# EAGLE schematic SBECU (EAGLE 9.6.2)
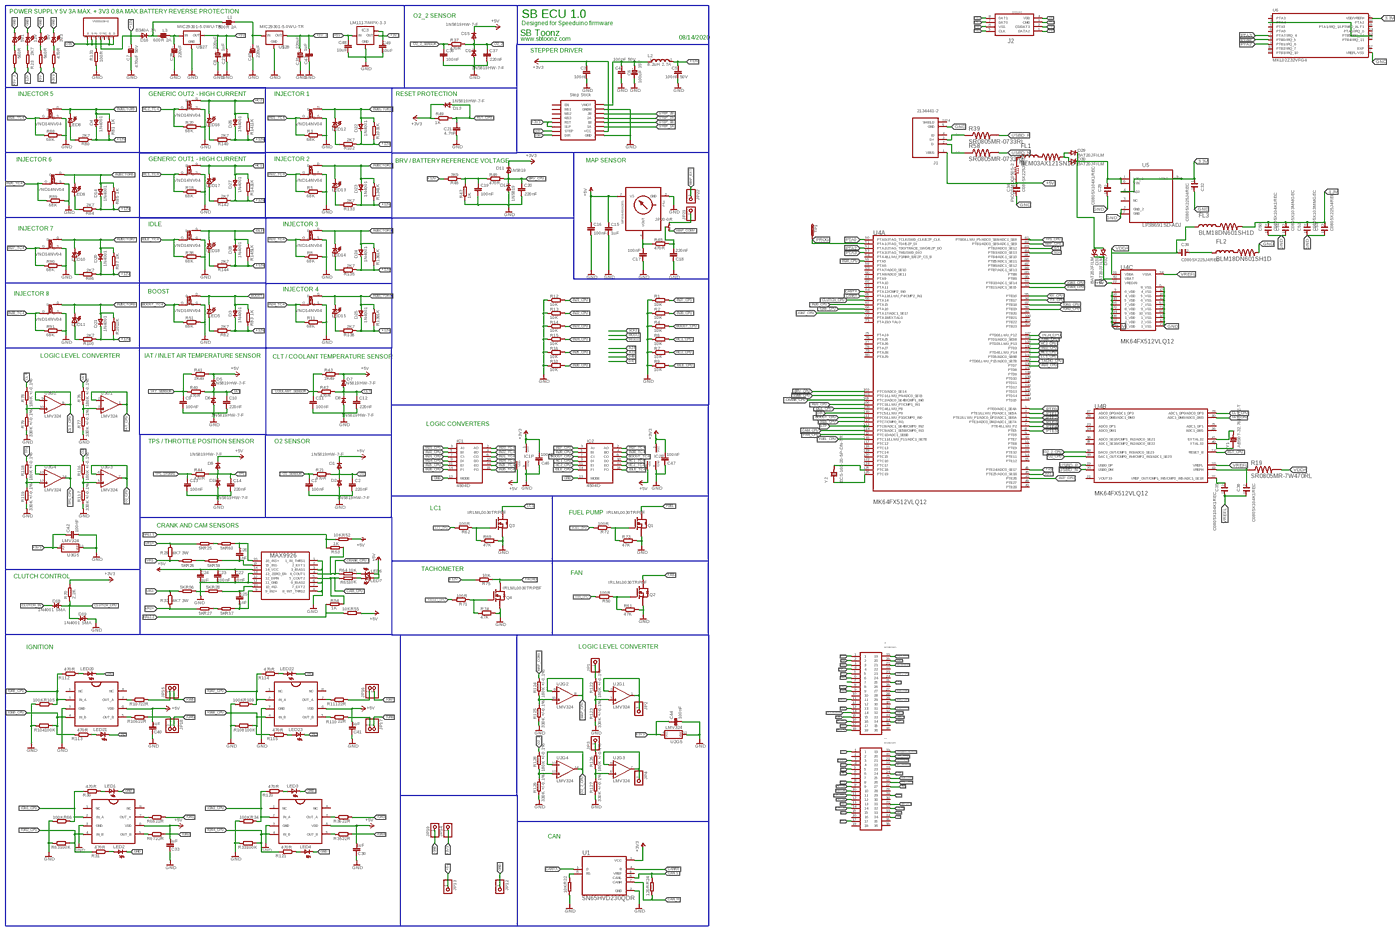
[diagram p0: schematic, sheet 1, overview]
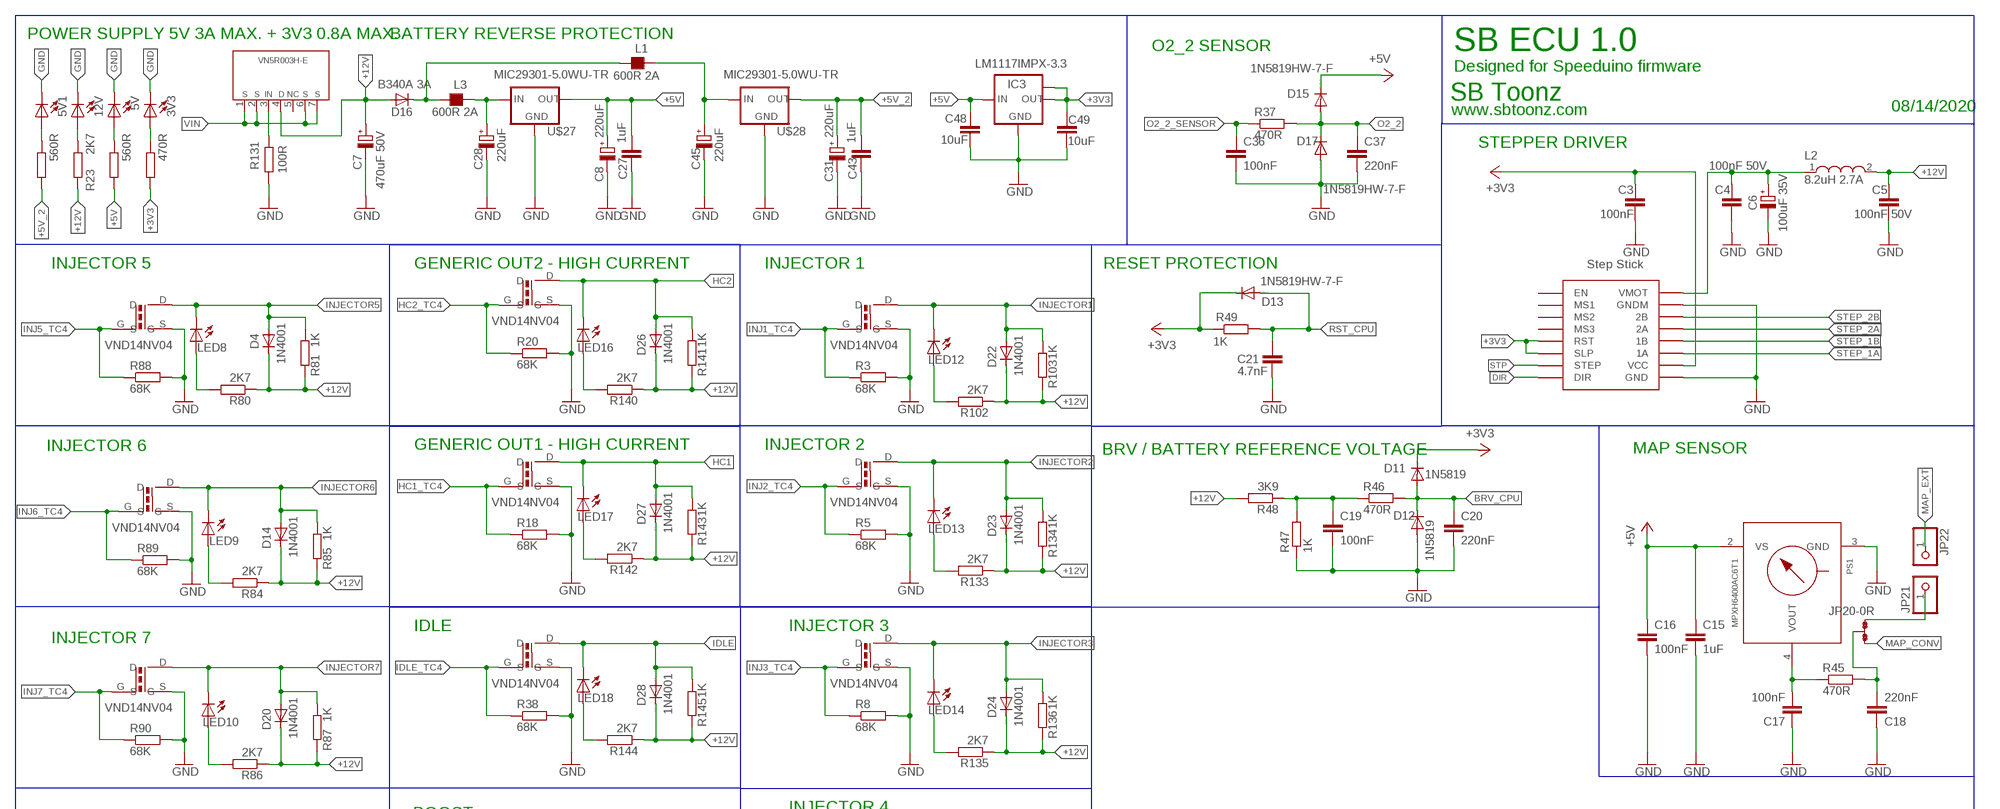
[diagram p1: schematic, sheet 1, part 1 of 4]
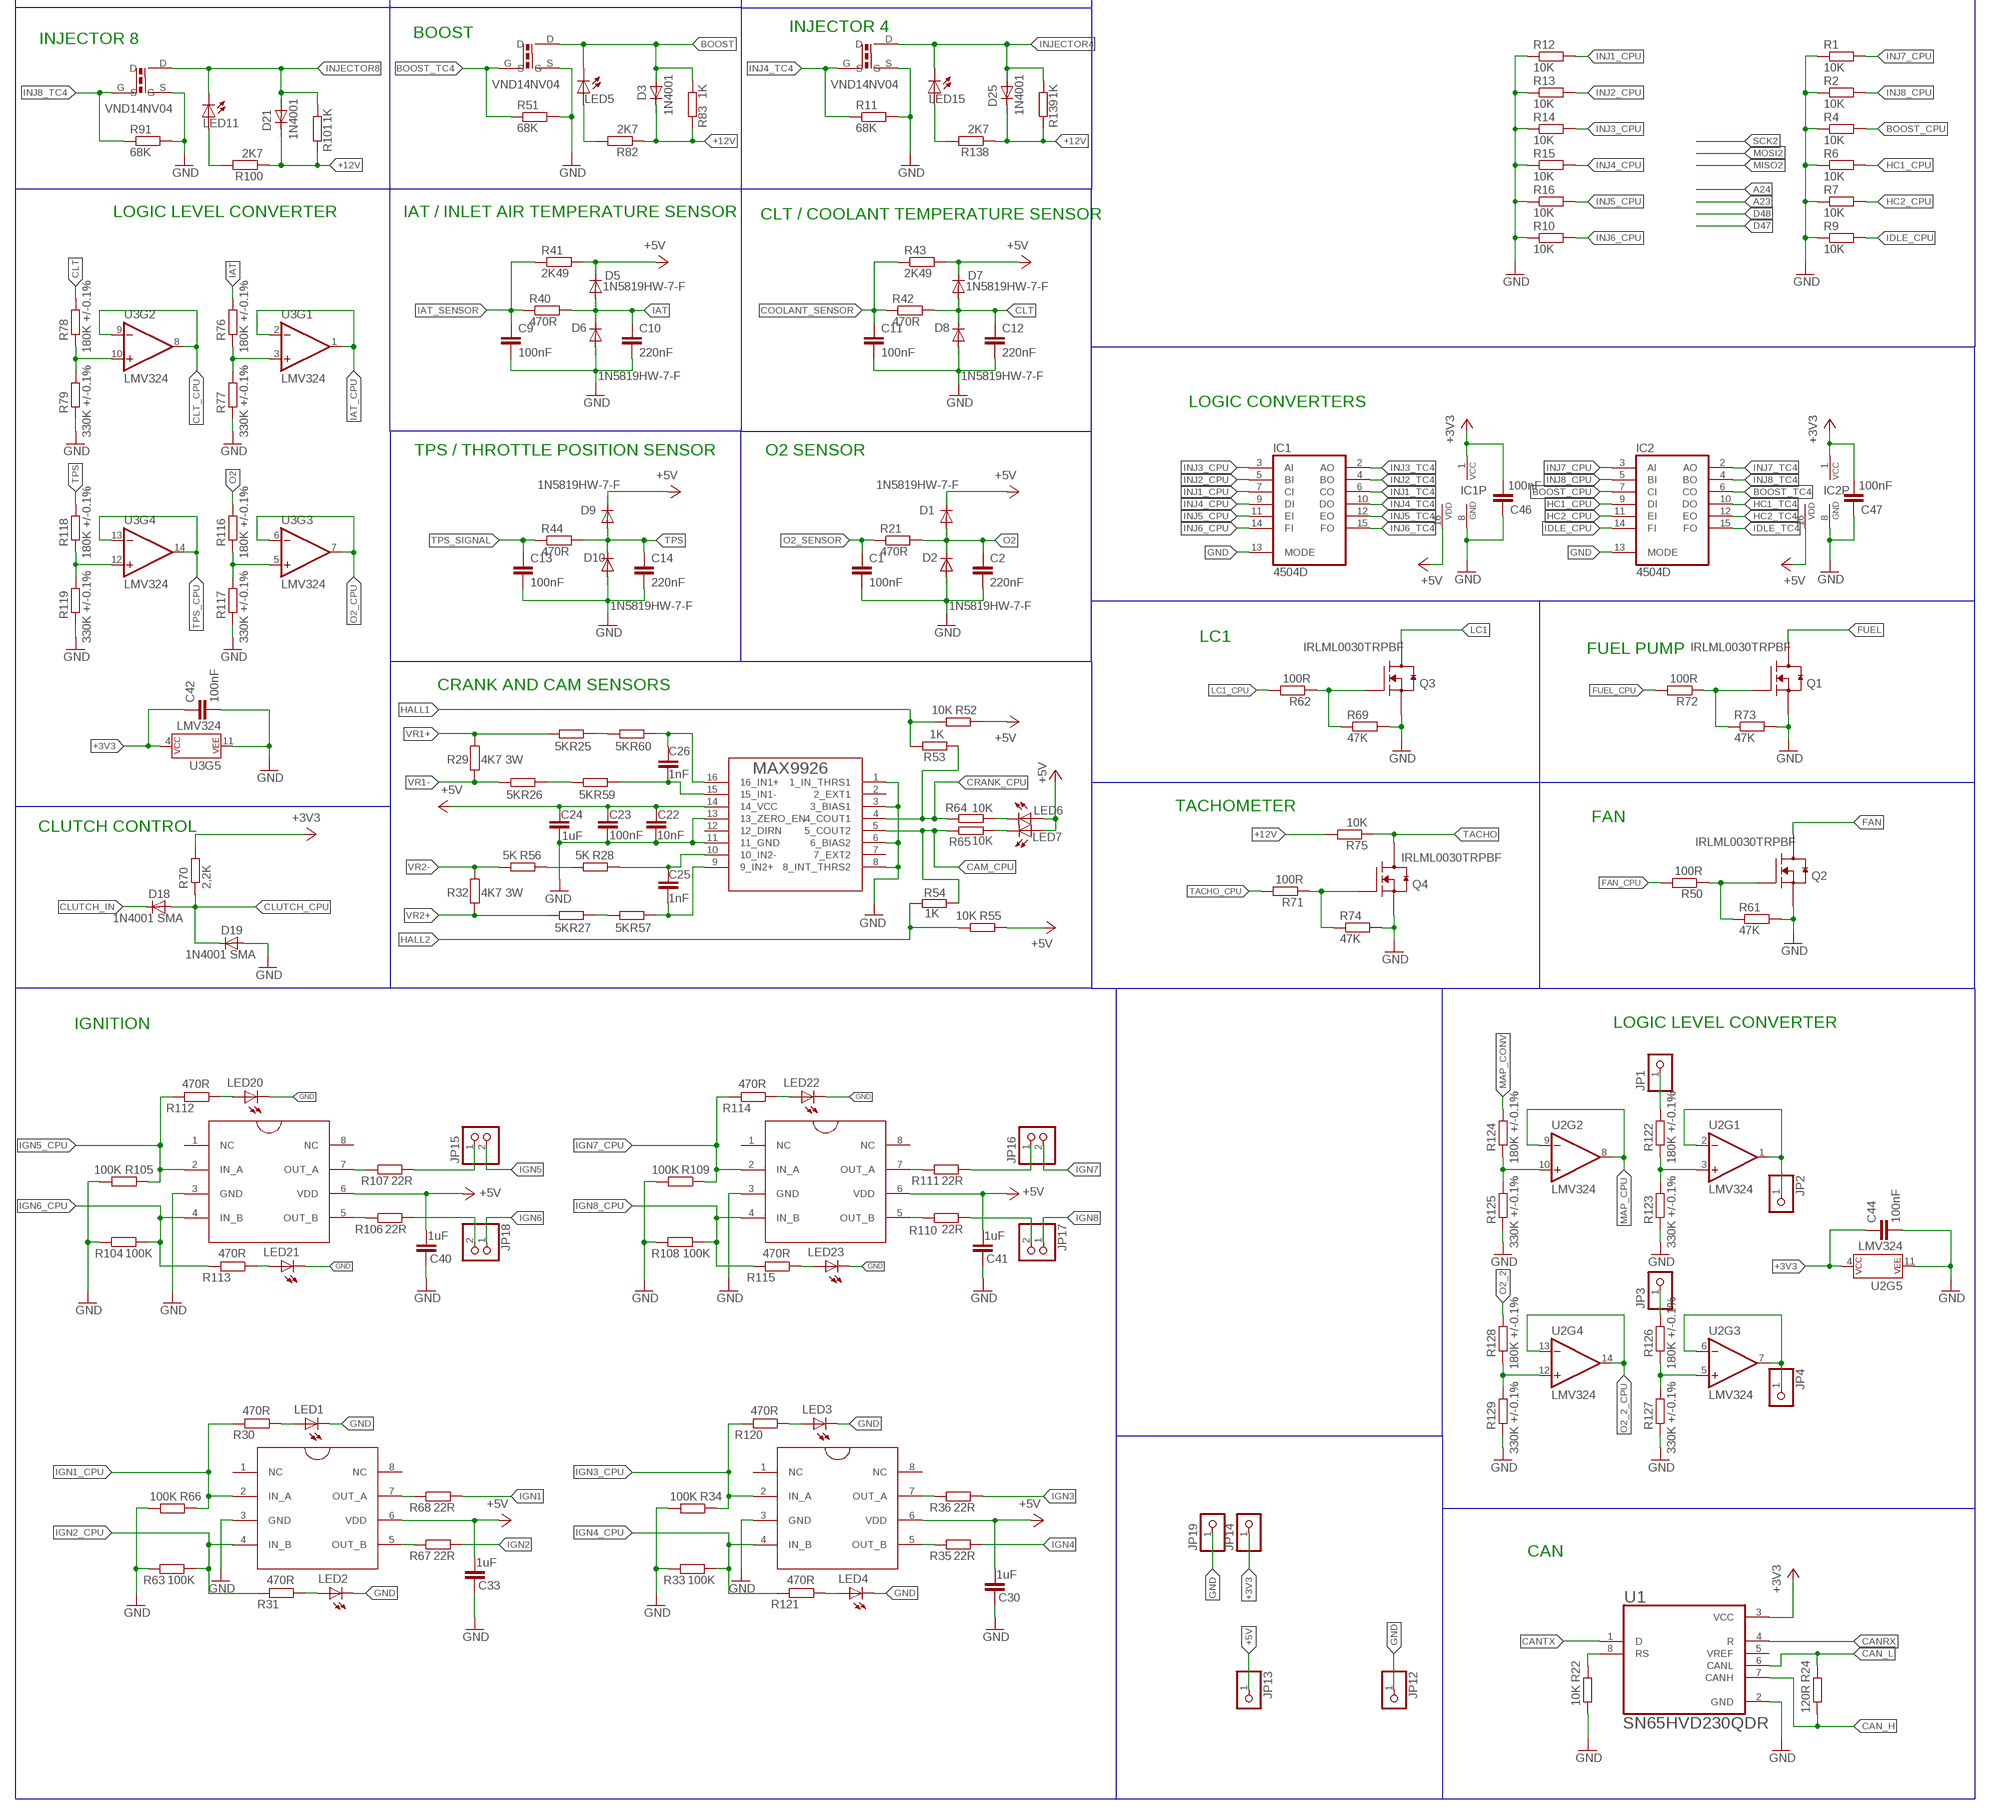
[diagram p2: schematic, sheet 1, part 2 of 4]
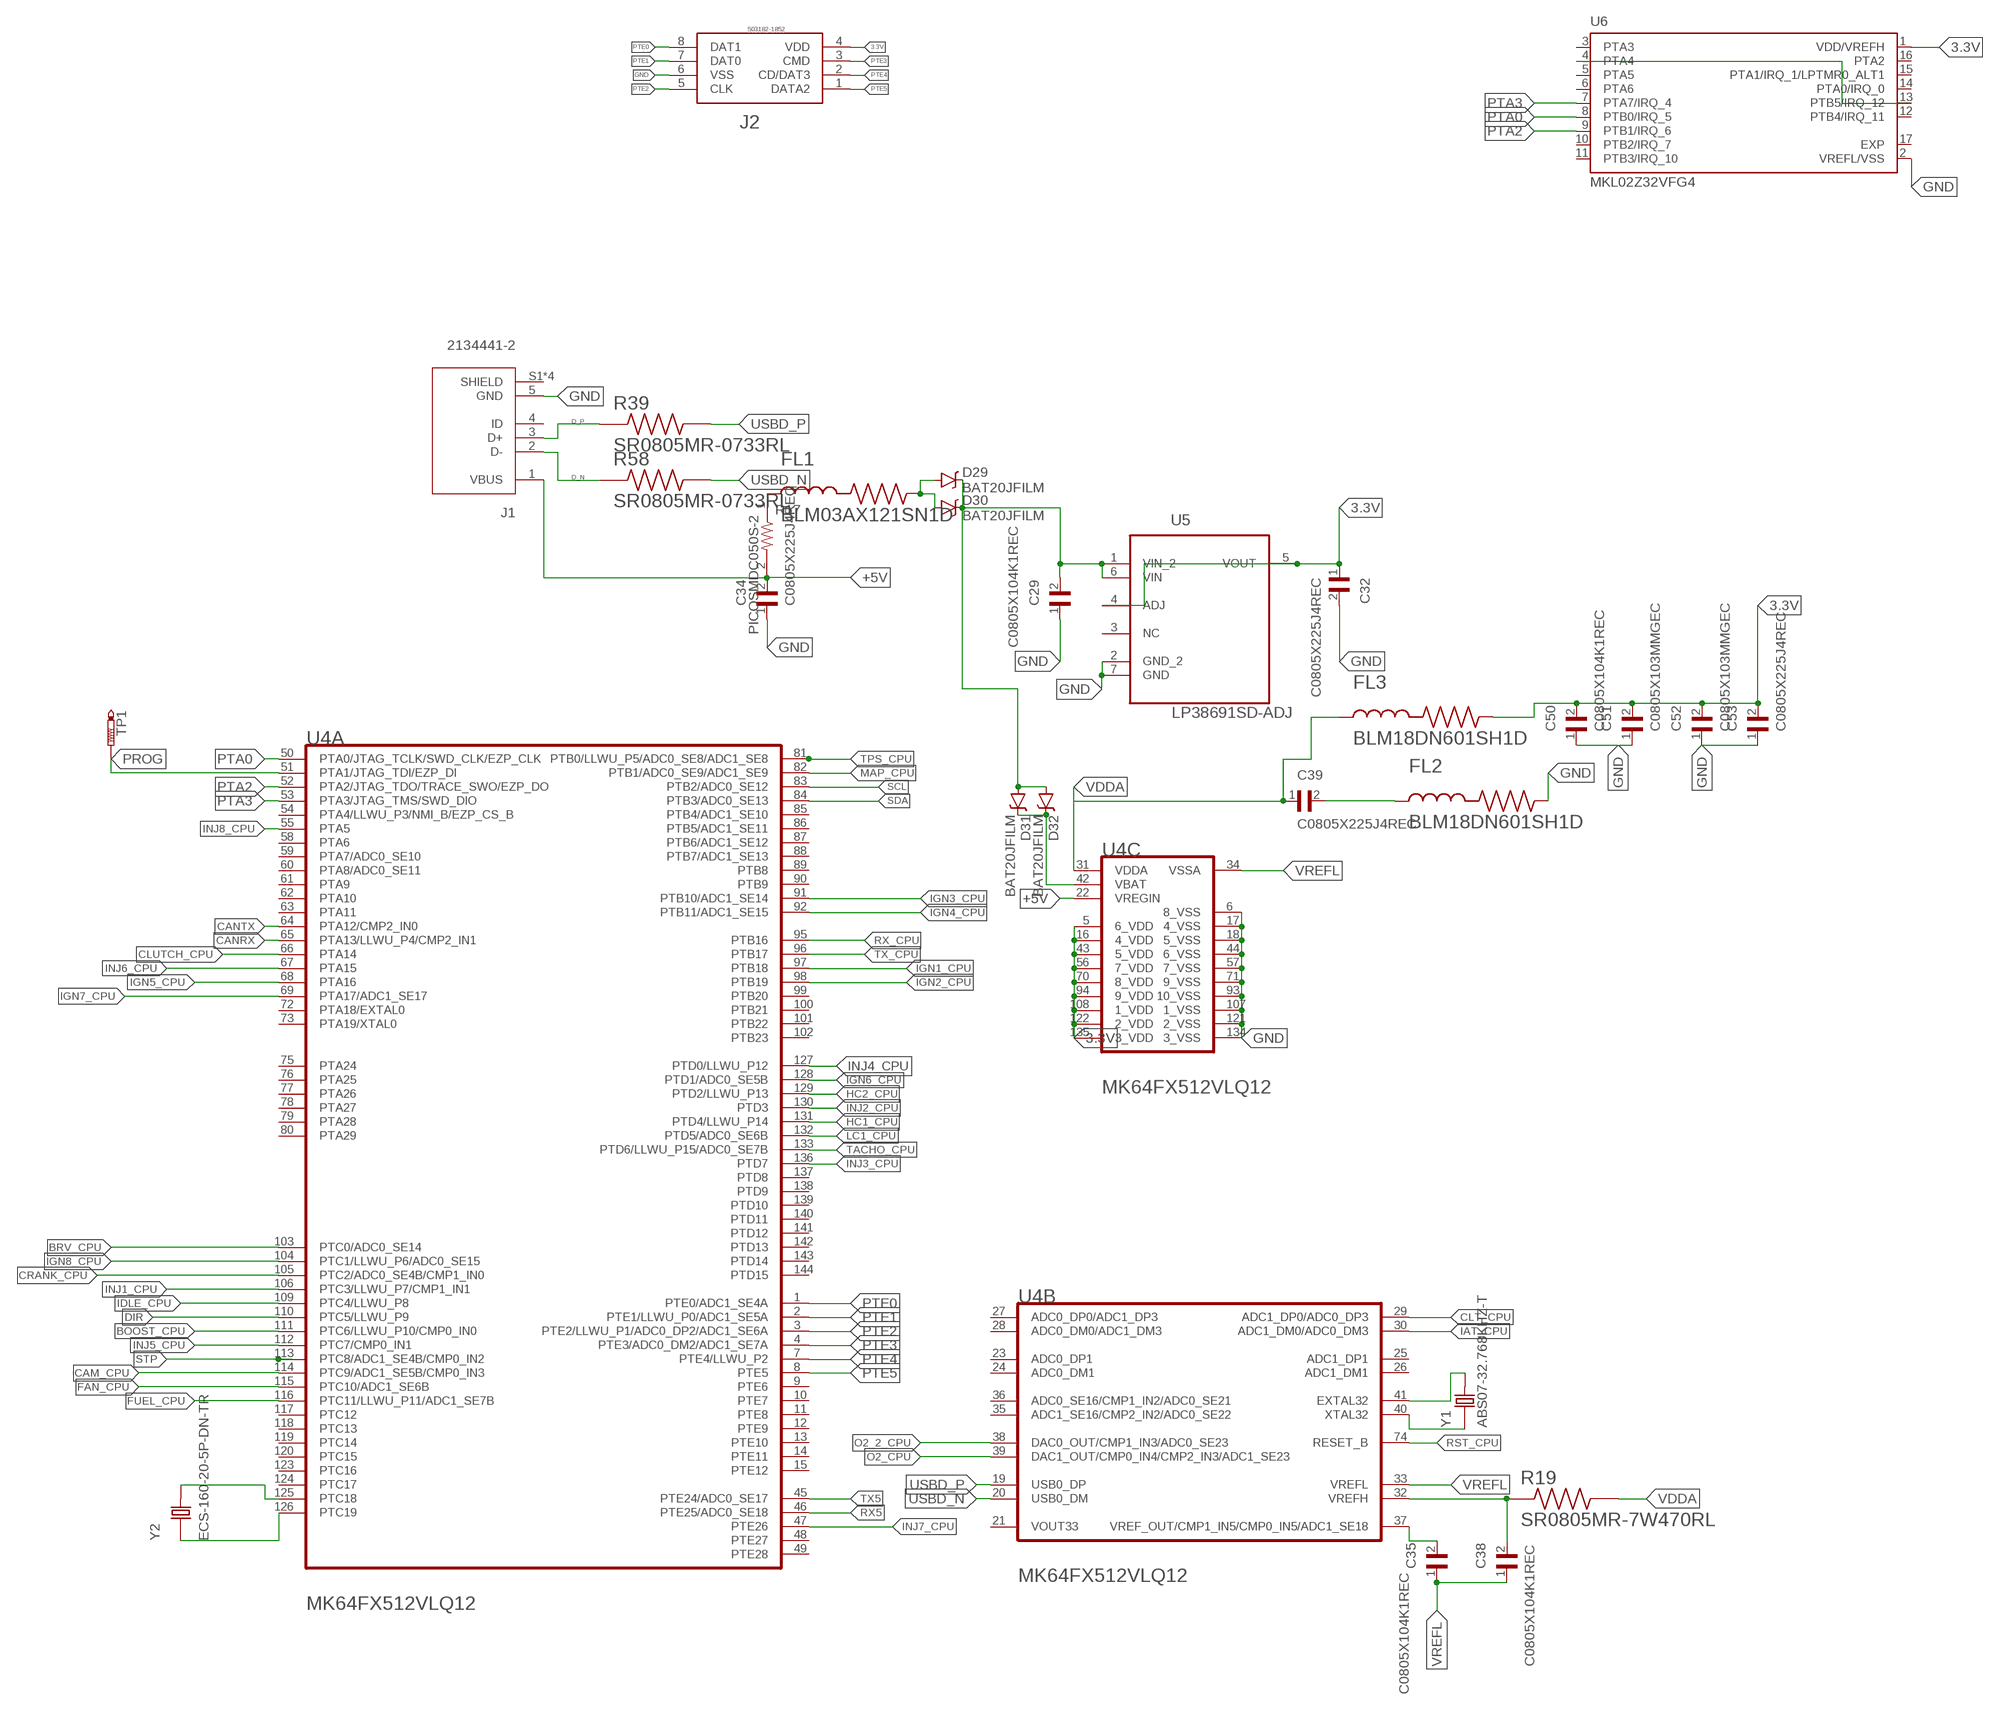
[diagram p3: schematic, sheet 1, part 3 of 4]
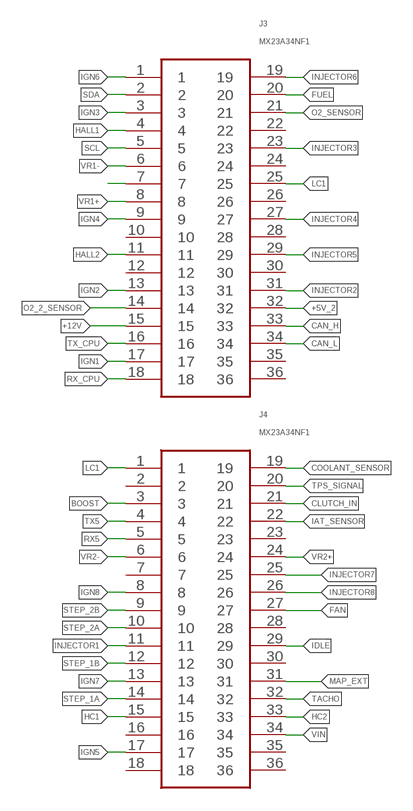
[diagram p4: schematic, sheet 1, part 4 of 4]

## Parts
3V3  LEDCHIP-LED0805  [CHIP-LED0805]
5V  LEDCHIP-LED0805  [CHIP-LED0805]
5V1  LEDCHIP-LED0805  [CHIP-LED0805]
12V  LEDCHIP-LED0805  [CHIP-LED0805]
C1  100nF  C-EUC0805  [C0805]
C2  220nF  C-EUC0805  [C0805]
C3  100nF  C-EUC0805  [C0805]
C4  100nF 50V  C-EUC0805  [C0805]
C5  100nF 50V  C-EUC0805  [C0805]
C6  100uF 35V  CPOL-EUD  [PANASONIC_D]
C7  470uF 50V  CPOL-EUG  [PANASONIC_G]
C8  220uF  CPOL-EUD  [PANASONIC_D]
C9  100nF  C-EUC0805  [C0805]
C10  220nF  C-EUC0805  [C0805]
C11  100nF  C-EUC0805  [C0805]
C12  220nF  C-EUC0805  [C0805]
C13  100nF  C-EUC0805  [C0805]
C14  220nF  C-EUC0805  [C0805]
C15  1uF  C-EUC0805  [C0805]
C16  100nF  C-EUC0805  [C0805]
C17  100nF  C-EUC0805  [C0805]
C18  220nF  C-EUC0805  [C0805]
C19  100nF  C-EUC0805  [C0805]
C20  220nF  C-EUC0805  [C0805]
C21  4.7nF  C-EUC0805  [C0805]
C22  10nF  C-EUC0805  [C0805]
C23  100nF  C-EUC0805  [C0805]
C24  1uF  C-EUC0805  [C0805]
C25  1nF  C-EUC0805  [C0805]
C26  1nF  C-EUC0805  [C0805]
C27  1uF  C-EUC0805  [C0805]
C28  220uF  CPOL-EUD  [PANASONIC_D]
C29  C0805X104K1REC  [CAPC2012X110N]
C30  1uF  C-EUC0805  [C0805]
C31  220uF  CPOL-EUD  [PANASONIC_D]
C32  C0805X225J4REC  [CAPC2012X140N]
C33  1uF  C-EUC0805  [C0805]
C34  C0805X225J4REC  [CAPC2012X140N]
C35  C0805X104K1REC  [CAPC2012X110N]
C36  100nF  C-EUC0805  [C0805]
C37  220nF  C-EUC0805  [C0805]
C38  C0805X104K1REC  [CAPC2012X110N]
C39  C0805X225J4REC  [CAPC2012X140N]
C40  1uF  C-EUC0805  [C0805]
C41  1uF  C-EUC0805  [C0805]
C42  100nF  C-EUC0805  [C0805]
C43  1uF  C-EUC0805  [C0805]
C44  100nF  C-EUC0805  [C0805]
C45  220uF  CPOL-EUD  [PANASONIC_D]
C46  100nF  C-EUC0805  [C0805]
C47  100nF  C-EUC0805  [C0805]
C48  10uF  C-EUC0805  [C0805]
C49  10uF  C-EUC0805  [C0805]
C50  C0805X104K1REC  [CAPC2012X110N]
C51  C0805X103MMGEC  [CAPC2012X100N]
C52  C0805X103MMGEC  [CAPC2012X100N]
C53  C0805X225J4REC  [CAPC2012X140N]
D1  1N5819HW-7-F  DIODE-SOD123  [SOD123]
D2  1N5819HW-7-F  DIODE-SOD123  [SOD123]
D3  1N4001  DIODE-D-2.5  [D-2.5]
D4  1N4001  DIODE-D-2.5  [D-2.5]
D5  1N5819HW-7-F  DIODE-SOD123  [SOD123]
D6  1N5819HW-7-F  DIODE-SOD123  [SOD123]
D7  1N5819HW-7-F  DIODE-SOD123  [SOD123]
D8  1N5819HW-7-F  DIODE-SOD123  [SOD123]
D9  1N5819HW-7-F  DIODE-SOD123  [SOD123]
D10  1N5819HW-7-F  DIODE-SOD123  [SOD123]
D11  1N5819  DIODE-SOD123  [SOD123]
D12  1N5819  DIODE-SOD123  [SOD123]
D13  1N5819HW-7-F  DIODE-SOD123  [SOD123]
D14  1N4001  DIODE-D-2.5  [D-2.5]
D15  1N5819HW-7-F  DIODE-SOD123  [SOD123]
D16  B340A 3A  S1A  [DO214AC]
D17  1N5819HW-7-F  DIODE-SOD123  [SOD123]
D18  1N4001 SMA  S1A  [DO214AC]
D19  1N4001 SMA  S1A  [DO214AC]
D20  1N4001  DIODE-D-2.5  [D-2.5]
D21  1N4001  DIODE-D-2.5  [D-2.5]
D22  1N4001  DIODE-D-2.5  [D-2.5]
D23  1N4001  DIODE-D-2.5  [D-2.5]
D24  1N4001  DIODE-D-2.5  [D-2.5]
D25  1N4001  DIODE-D-2.5  [D-2.5]
D26  1N4001  DIODE-D-2.5  [D-2.5]
D27  1N4001  DIODE-D-2.5  [D-2.5]
D28  1N4001  DIODE-D-2.5  [D-2.5]
D29  BAT20JFILM  [SOD-323]
D30  BAT20JFILM  [SOD-323]
D31  BAT20JFILM  [SOD-323]
D32  BAT20JFILM  [SOD-323]
FL1  BLM03AX121SN1D  [BEADC0603X33N]
FL2  BLM18DN601SH1D  [BEADC1608X95N]
FL3  BLM18DN601SH1D  [BEADC1608X95N]
IC1  4504D  [SO16]
IC2  4504D  [SO16]
IC3  LM1117IMPX-3.3  [SOT223]
J1  2134441-2  [TE_2134441-2]
J2  503182-1852  [5031821852]
J3  MX23A34NF1  [MX23A34NF1]
J4  MX23A34NF1  [MX23A34NF1]
JP1  PINHD-1X1  [1X01]
JP2  PINHD-1X1  [1X01]
JP3  PINHD-1X1  [1X01]
JP4  PINHD-1X1  [1X01]
JP12  PINHD-1X1  [1X01]
JP13  PINHD-1X1  [1X01]
JP14  PINHD-1X1  [1X01]
JP15  PINHD-1X2  [1X02]
JP16  PINHD-1X2  [1X02]
JP17  PINHD-1X2  [1X02]
JP18  PINHD-1X2  [1X02]
JP19  PINHD-1X1  [1X01]
JP20  0R-JUMPA  [A0R-JMP]
JP21  PINHD-1X1  [1X01]
JP22  PINHD-1X1  [1X01]
L1  600R 2A  FB_1206  [L1206]
L2  8.2uH 2.7A  WE-PD_7332/7345_PLASTIC_BASE  [WE-PD_7332/7345_PLASTIC_BASE]
L3  600R 2A  FB_1206  [L1206]
LED1  LEDCHIP-LED0805  [CHIP-LED0805]
LED2  LEDCHIP-LED0805  [CHIP-LED0805]
LED3  LEDCHIP-LED0805  [CHIP-LED0805]
LED4  LEDCHIP-LED0805  [CHIP-LED0805]
LED5  LEDCHIPLED_0805  [CHIPLED_0805]
LED6  LEDCHIP-LED0805  [CHIP-LED0805]
LED7  LEDCHIP-LED0805  [CHIP-LED0805]
LED8  LEDCHIPLED_0805  [CHIPLED_0805]
LED9  LEDCHIPLED_0805  [CHIPLED_0805]
LED10  LEDCHIPLED_0805  [CHIPLED_0805]
LED11  LEDCHIPLED_0805  [CHIPLED_0805]
LED12  LEDCHIPLED_0805  [CHIPLED_0805]
LED13  LEDCHIPLED_0805  [CHIPLED_0805]
LED14  LEDCHIPLED_0805  [CHIPLED_0805]
LED15  LEDCHIPLED_0805  [CHIPLED_0805]
LED16  LEDCHIPLED_0805  [CHIPLED_0805]
LED17  LEDCHIPLED_0805  [CHIPLED_0805]
LED18  LEDCHIPLED_0805  [CHIPLED_0805]
LED20  LEDCHIP-LED0805  [CHIP-LED0805]
LED21  LEDCHIP-LED0805  [CHIP-LED0805]
LED22  LEDCHIP-LED0805  [CHIP-LED0805]
LED23  LEDCHIP-LED0805  [CHIP-LED0805]
PS1  MPXH6400AC6T1  [1317A]
Q1  IRLML0030TRPBF  MOSFET-NCH_SOT-23  [SOT95P280X135-3N]
Q2  IRLML0030TRPBF  MOSFET-NCH_SOT-23  [SOT95P280X135-3N]
Q3  IRLML0030TRPBF  MOSFET-NCH_SOT-23  [SOT95P280X135-3N]
Q4  IRLML0030TRPBF  MOSFET-NCH_SOT-23  [SOT95P280X135-3N]
R1  10K  R-EU_R0805  [R0805]
R2  10K  R-EU_R0805  [R0805]
R3  68K  R-EU_R0805  [R0805]
R4  10K  R-EU_R0805  [R0805]
R5  68K  R-EU_R0805  [R0805]
R6  10K  R-EU_R0805  [R0805]
R7  10K  R-EU_R0805  [R0805]
R8  68K  R-EU_R0805  [R0805]
R9  10K  R-EU_R0805  [R0805]
R10  10K  R-EU_R0805  [R0805]
R11  68K  R-EU_R0805  [R0805]
R12  10K  R-EU_R0805  [R0805]
R13  10K  R-EU_R0805  [R0805]
R14  10K  R-EU_R0805  [R0805]
R15  10K  R-EU_R0805  [R0805]
R16  10K  R-EU_R0805  [R0805]
R17  PICOSMDC050S-2  [RESC2012X65N]
R18  68K  R-EU_R0805  [R0805]
R19  SR0805MR-7W470RL  [RESC2012X60N]
R20  68K  R-EU_R0805  [R0805]
R21  470R  R-EU_R0805  [R0805]
R22  10K  R-EU_R0805  [R0805]
R23  2K7  R-EU_R0805  [R0805]
R24  120R  R-EU_R0805  [R0805]
R25  5K  R-EU_R0805  [R0805]
R26  5K  R-EU_R0805  [R0805]
R27  5K  R-EU_R0805  [R0805]
R28  5K  R-EU_R0805  [R0805]
R29  4K7 3W  R-EU_R2512  [R2512]
R30  470R  R-EU_R0805  [R0805]
R31  470R  R-EU_R0805  [R0805]
R32  4K7 3W  R-EU_R2512  [R2512]
R33  100K  R-EU_R0805  [R0805]
R34  100K  R-EU_R0805  [R0805]
R35  22R  R-EU_M1206  [M1206]
R36  22R  R-EU_M1206  [M1206]
R37  470R  R-EU_R0805  [R0805]
R38  68K  R-EU_R0805  [R0805]
R39  SR0805MR-0733RL  [RESC2012X60N]
R40  470R  R-EU_R0805  [R0805]
R41  2K49  R-EU_R0805  [R0805]
R42  470R  R-EU_R0805  [R0805]
R43  2K49  R-EU_R0805  [R0805]
R44  470R  R-EU_R0805  [R0805]
R45  470R  R-EU_R0805  [R0805]
R46  470R  R-EU_R0805  [R0805]
R47  1K  R-EU_R0805  [R0805]
R48  3K9  R-EU_R0805  [R0805]
R49  1K  R-EU_R0805  [R0805]
R50  100R  R-EU_R0805  [R0805]
R51  68K  R-EU_R0805  [R0805]
R52  10K  R-EU_R0805  [R0805]
R53  1K  R-EU_R0805  [R0805]
R54  1K  R-EU_R0805  [R0805]
R55  10K  R-EU_R0805  [R0805]
R56  5K  R-EU_R0805  [R0805]
R57  5K  R-EU_R0805  [R0805]
R58  SR0805MR-0733RL  [RESC2012X60N]
R59  5K  R-EU_R0805  [R0805]
R60  5K  R-EU_R0805  [R0805]
R61  47K  R-EU_R0805  [R0805]
R62  100R  R-EU_R0805  [R0805]
R63  100K  R-EU_R0805  [R0805]
R64  10K  R-EU_R0805  [R0805]
R65  10K  R-EU_R0805  [R0805]
R66  100K  R-EU_R0805  [R0805]
R67  22R  R-EU_M1206  [M1206]
R68  22R  R-EU_M1206  [M1206]
R69  47K  R-EU_R0805  [R0805]
R70  2,2K  R-EU_R0805  [R0805]
R71  100R  R-EU_R0805  [R0805]
R72  100R  R-EU_R0805  [R0805]
R73  47K  R-EU_R0805  [R0805]
R74  47K  R-EU_R0805  [R0805]
R75  10K  R-EU_R0805  [R0805]
R76  180K +/-0.1%  R-EU_R0805  [R0805]
R77  330K +/-0.1%  R-EU_R0805  [R0805]
R78  180K +/-0.1%  R-EU_R0805  [R0805]
R79  330K +/-0.1%  R-EU_R0805  [R0805]
R80  2K7  R-EU_R0805  [R0805]
R81  1K  R-EU_R0805  [R0805]
R82  2K7  R-EU_R0805  [R0805]
R83  1K  R-EU_R0805  [R0805]
R84  2K7  R-EU_R0805  [R0805]
R85  1K  R-EU_R0805  [R0805]
R86  2K7  R-EU_R0805  [R0805]
R87  1K  R-EU_R0805  [R0805]
R88  68K  R-EU_R0805  [R0805]
R89  68K  R-EU_R0805  [R0805]
R90  68K  R-EU_R0805  [R0805]
R91  68K  R-EU_R0805  [R0805]
R100  2K7  R-EU_R0805  [R0805]
R101  1K  R-EU_R0805  [R0805]
R102  2K7  R-EU_R0805  [R0805]
R103  1K  R-EU_R0805  [R0805]
R104  100K  R-EU_R0805  [R0805]
R105  100K  R-EU_R0805  [R0805]
R106  22R  R-EU_M1206  [M1206]
R107  22R  R-EU_M1206  [M1206]
R108  100K  R-EU_R0805  [R0805]
R109  100K  R-EU_R0805  [R0805]
R110  22R  R-EU_M1206  [M1206]
R111  22R  R-EU_M1206  [M1206]
R112  470R  R-EU_R0805  [R0805]
R113  470R  R-EU_R0805  [R0805]
R114  470R  R-EU_R0805  [R0805]
R115  470R  R-EU_R0805  [R0805]
R116  180K +/-0.1%  R-EU_R0805  [R0805]
R117  330K +/-0.1%  R-EU_R0805  [R0805]
R118  180K +/-0.1%  R-EU_R0805  [R0805]
R119  330K +/-0.1%  R-EU_R0805  [R0805]
R120  470R  R-EU_R0805  [R0805]
R121  470R  R-EU_R0805  [R0805]
R122  180K +/-0.1%  R-EU_R0805  [R0805]
R123  330K +/-0.1%  R-EU_R0805  [R0805]
R124  180K +/-0.1%  R-EU_R0805  [R0805]
R125  330K +/-0.1%  R-EU_R0805  [R0805]
R126  180K +/-0.1%  R-EU_R0805  [R0805]
R127  330K +/-0.1%  R-EU_R0805  [R0805]
R128  180K +/-0.1%  R-EU_R0805  [R0805]
R129  330K +/-0.1%  R-EU_R0805  [R0805]
R130  560R  R-EU_R0805  [R0805]
R131  100R  R-EU_R0805  [R0805]
R132  560R  R-EU_R0805  [R0805]
R133  2K7  R-EU_R0805  [R0805]
R134  1K  R-EU_R0805  [R0805]
R135  2K7  R-EU_R0805  [R0805]
R136  1K  R-EU_R0805  [R0805]
R137  470R  R-EU_R0805  [R0805]
R138  2K7  R-EU_R0805  [R0805]
R139  1K  R-EU_R0805  [R0805]
R140  2K7  R-EU_R0805  [R0805]
R141  1K  R-EU_R0805  [R0805]
R142  2K7  R-EU_R0805  [R0805]
R143  1K  R-EU_R0805  [R0805]
R144  2K7  R-EU_R0805  [R0805]
R145  1K  R-EU_R0805  [R0805]
STEPSTICK-X  STEP-STICK  [STEP-STICK]
TP1  PTR1PAD1-13  [P1-13]
U1  SN65HVD230QDR  [SOIC127P600X175-8N]
U2  LMV324  [SO14]
U3  LMV324  [SO14]
U4  FREESCALE_SEMICONDUCTOR_MK64FX512VLQ12FREESCALE_SEMICONDUCTOR_MK64FX512VLQ12_0_0  [FREESCALE_SEMICONDUCTOR_MK64FX512VLQ12_0]
U5  LP38691SD-ADJ  [DFN300X300X80-7N]
U6  MKL02Z32VFG4  [QFN50P300X300X65-17N]
U$2  DPAK_N-CHANNEL_MOSFET  [DPAK_N-CHANNEL_MOSFET]
U$3  DPAK_N-CHANNEL_MOSFET  [DPAK_N-CHANNEL_MOSFET]
U$4  DPAK_N-CHANNEL_MOSFET  [DPAK_N-CHANNEL_MOSFET]
U$5  DPAK_N-CHANNEL_MOSFET  [DPAK_N-CHANNEL_MOSFET]
U$6  DPAK_N-CHANNEL_MOSFET  [DPAK_N-CHANNEL_MOSFET]
U$8  DPAK_N-CHANNEL_MOSFET  [DPAK_N-CHANNEL_MOSFET]
U$9  TC427SO-8  [SO-8]
U$10  MAX9926  [QSOP16]
U$11  TC427SO-8  [SO-8]
U$12  DPAK_N-CHANNEL_MOSFET  [DPAK_N-CHANNEL_MOSFET]
U$13  DPAK_N-CHANNEL_MOSFET  [DPAK_N-CHANNEL_MOSFET]
U$18  VN5R003H-E  [VN5R003H-E_HPAK_TO267_7]
U$19  DPAK_N-CHANNEL_MOSFET  [DPAK_N-CHANNEL_MOSFET]
U$20  DPAK_N-CHANNEL_MOSFET  [DPAK_N-CHANNEL_MOSFET]
U$21  DPAK_N-CHANNEL_MOSFET  [DPAK_N-CHANNEL_MOSFET]
U$22  DPAK_N-CHANNEL_MOSFET  [DPAK_N-CHANNEL_MOSFET]
U$25  TC427SO-8  [SO-8]
U$26  TC427SO-8  [SO-8]
U$27  MIC29301-5.0WU-TR  [TO263-3]
U$28  MIC29301-5.0WU-TR  [TO263-3]
Y1  ABS07-32.768KHZ-T  [XTAL_ABS07-32.768KHZ-T]
Y2  ECS-160-20-5P-DN-TR  [XTAL_ECS-160-20-5P-DN-TR]

## Nets
3.3V: C32.1 C50.2 C51.2 C52.2 C53.2 FL3.2 J2.4(VDD) U4.5(C:6_VDD) U4.16(C:4_VDD) U4.43(C:5_VDD) U4.56(C:7_VDD) U4.70(C:8_VDD) U4.94(C:9_VDD) U4.108(C:1_VDD) U4.122(C:2_VDD) U4.135(C:3_VDD) U5.4(ADJ) U5.5(VOUT) U6.1(VDD/VREFH)
+3V3: C3.1 C42.1 C44.1 C46.2 C47.2 C49.1 D11.C D13.C IC1.1(VCC) IC2.1(VCC) IC3.2(OUT) IC3.TAB(OUT1) JP14.1 R49.1 R70.2 R137.2 STEPSTICK-X.RST STEPSTICK-X.SLP STEPSTICK-X.VCC U1.3(VCC) U2.4(P$V+) U3.4(P$V+)
+5V: C8.+ C15.1 C16.1 C22.1 C23.1 C24.1 C27.1 C30.2 C33.2 C34.2 C40.2 C41.2 C48.1 D1.C D5.C D7.C D9.C D15.C IC1.16(VDD) IC2.16(VDD) IC3.3(IN) J1.1(VBUS) JP13.1 LED6.A LED7.A PS1.2(VS) R17.2 R41.2 R43.2 R52.1 R55.1 R130.2 U4.22(C:VREGIN) U$9.6(VDD) U$10.14(14_VCC) U$11.6(VDD) U$25.6(VDD) U$26.6(VDD) U$27.3(OUT)
+5V_2: C31.+ C43.1 J3.32 R132.2 U$28.3(OUT)
+12V: C5.1 C7.+ D3.C D4.C D14.C D16.A D20.C D21.C D22.C D23.C D24.C D25.C D26.C D27.C D28.C J3.15 L2.2 R23.2 R48.2 R75.2 R80.1 R81.1 R82.1 R83.1 R84.1 R85.1 R86.1 R87.1 R100.1 R101.1 R102.1 R103.1 R133.1 R134.1 R135.1 R136.1 R138.1 R139.1 R140.1 R141.1 R142.1 R143.1 R144.1 R145.1 U$18.4
BOOST: D3.A J4.3 LED5.C R83.2 U$13.D
BOOST_CPU: IC2.7(CI) R4.2 U4.111(A:PTC6/LLWU_P10/CMP0_IN0)
BOOST_TC4: IC2.6(CO) R51.1 U$13.G
BRV_CPU: C20.1 D11.A D12.C R46.2 U4.103(A:PTC0/ADC0_SE14)
CAM_CPU: R54.1 R65.1 U4.114(A:PTC9/ADC1_SE5B/CMP0_IN3) U$10.5(5_COUT2)
CAN_H: J3.33 R24.2 U1.7(CANH)
CAN_L: J3.34 R24.1 U1.6(CANL)
CANRX: U1.4(R) U4.65(A:PTA13/LLWU_P4/CMP2_IN1)
CANTX: U1.1(D) U4.64(A:PTA12/CMP2_IN0)
CLT: C12.1 D7.A D8.C R42.2 R78.2
CLT_CPU: U3.8(OUT) U3.9(-IN) U4.29(B:ADC1_DP0/ADC0_DP3)
CLUTCH_CPU: D18.A D19.C R70.1 U4.66(A:PTA14)
CLUTCH_IN: D18.C J4.21
COOLANT_SENSOR: C11.1 J4.19 R42.1 R43.1
CRANK_CPU: R53.2 R64.1 U4.105(A:PTC2/ADC0_SE4B/CMP1_IN0) U$10.4(4_COUT1)
D_N: J1.2(D-) R58.1
D_P: J1.3(D+) R39.1
DIR: STEPSTICK-X.DIR U4.110(A:PTC5/LLWU_P9)
FAN: J4.27 Q2.3(D)
FAN_CPU: R50.2 U4.115(A:PTC10/ADC1_SE6B)
FUEL: J3.20 Q1.3(D)
FUEL_CPU: R72.2 U4.116(A:PTC11/LLWU_P11/ADC1_SE7B)
GND: 3V3.C 5V1.C 5V.C 12V.C C1.2 C2.2 C3.2 C4.2 C5.2 C6.- C7.- C8.- C9.2 C10.2 C11.2 C12.2 C13.2 C14.2 C15.2 C16.2 C17.1 C18.1 C19.2 C20.2 C21.2 C22.2 C23.2 C24.2 C27.2 C28.- C29.1 C30.1 C31.- C32.2 C33.1 C34.1 C36.2 C37.2 C40.1 C41.1 C42.2 C43.2 C44.2 C45.- C46.1 C47.1 C48.2 C49.2 C50.1 C51.1 C52.1 C53.1 D2.A D6.A D8.A D10.A D12.A D17.A D19.A FL2.2 IC1.8(GND) IC1.13(MODE) IC2.8(GND) IC2.13(MODE) IC3.1(GND) J1.5(GND) J2.6(VSS) JP12.1 JP19.1 LED1.C LED2.C LED3.C LED4.C LED20.C LED21.C LED22.C LED23.C PS1.3(GND) Q1.2(S) Q2.2(S) Q3.2(S) Q4.2(S) R1.1 R2.1 R3.2 R4.1 R5.2 R6.1 R7.1 R8.2 R9.1 R10.1 R11.2 R12.1 R13.1 R14.1 R15.1 R16.1 R18.2 R20.2 R22.2 R33.1 R34.2 R38.2 R47.1 R51.2 R61.2 R63.1 R66.2 R69.2 R73.2 R74.2 R77.1 R79.1 R88.2 R89.2 R90.2 R91.2 R104.1 R105.2 R108.1 R109.2 R117.1 R119.1 R123.1 R125.1 R127.1 R129.1 R131.1 STEPSTICK-X.GND STEPSTICK-X.GNDM U1.2(GND) U2.11(P$V-) U3.11(P$V-) U4.6(C:8_VSS) U4.17(C:4_VSS) U4.18(C:5_VSS) U4.44(C:6_VSS) U4.57(C:7_VSS) U4.71(C:9_VSS) U4.93(C:10_VSS) U4.107(C:1_VSS) U4.121(C:2_VSS) U4.134(C:3_VSS) U5.2(GND_2) U5.7(GND) U6.2(VREFL/VSS) U$2.S U$3.S U$4.S U$5.S U$6.S U$8.S U$9.3(GND) U$10.1(1_IN_THRS1) U$10.3(3_BIAS1) U$10.6(6_BIAS2) U$10.8(8_INT_THRS2) U$10.11(11_GND) U$10.13(13_ZERO_EN) U$11.3(GND) U$12.S U$13.S U$19.S U$20.S U$21.S U$22.S U$25.3(GND) U$26.3(GND) U$27.TAB(GND) U$28.TAB(GND)
HALL1: J3.4 R52.2 R53.1
HALL2: J3.11 R54.2 R55.2
HC1: D27.A J4.15 LED17.C R143.2 U$3.D
HC1_CPU: IC2.9(DI) R6.2 U4.131(A:PTD4/LLWU_P14)
HC1_TC4: IC2.10(DO) R18.1 U$3.G
HC2: D26.A J4.33 LED16.C R141.2 U$2.D
HC2_CPU: IC2.11(EI) R7.2 U4.129(A:PTD2/LLWU_P13)
HC2_TC4: IC2.12(EO) R20.1 U$2.G
IAT: C10.1 D5.A D6.C R40.2 R76.2
IAT_CPU: U3.1(OUT) U3.2(-IN) U4.30(B:ADC1_DM0/ADC0_DM3)
IAT_SENSOR: C9.1 J4.22 R40.1 R41.1
IDLE: D28.A J4.29 LED18.C R145.2 U$5.D
IDLE_CPU: IC2.14(FI) R9.2 U4.109(A:PTC4/LLWU_P8)
IDLE_TC4: IC2.15(FO) R38.1 U$5.G
IGN1: J3.17 R68.2
IGN1_CPU: R30.2 R66.1 U4.97(A:PTB18) U$9.2(IN_A)
IGN2: J3.13 R67.2
IGN2_CPU: R31.2 R63.2 U4.98(A:PTB19) U$9.4(IN_B)
IGN3: J3.3 R36.2
IGN3_CPU: R34.1 R120.2 U4.91(A:PTB10/ADC1_SE14) U$11.2(IN_A)
IGN4: J3.9 R35.2
IGN4_CPU: R33.2 R121.2 U4.92(A:PTB11/ADC1_SE15) U$11.4(IN_B)
IGN5: J4.17 JP15.2
IGN5_CPU: R105.1 R112.2 U4.68(A:PTA16) U$25.2(IN_A)
IGN6: J3.1 JP18.1
IGN6_CPU: R104.2 R113.2 U4.128(A:PTD1/ADC0_SE5B) U$25.4(IN_B)
IGN7: J4.13 JP16.2
IGN7_CPU: R109.1 R114.2 U4.69(A:PTA17/ADC1_SE17) U$26.2(IN_A)
IGN8: J4.8 JP17.1
IGN8_CPU: R108.2 R115.2 U4.104(A:PTC1/LLWU_P6/ADC0_SE15) U$26.4(IN_B)
INJ1_CPU: IC1.7(CI) R12.2 U4.106(A:PTC3/LLWU_P7/CMP1_IN1)
INJ1_TC4: IC1.6(CO) R3.1 U$12.G
INJ2_CPU: IC1.5(BI) R13.2 U4.130(A:PTD3)
INJ2_TC4: IC1.4(BO) R5.1 U$4.G
INJ3_CPU: IC1.3(AI) R14.2 U4.136(A:PTD7)
INJ3_TC4: IC1.2(AO) R8.1 U$6.G
INJ4_CPU: IC1.9(DI) R15.2 U4.127(A:PTD0/LLWU_P12)
INJ4_TC4: IC1.10(DO) R11.1 U$8.G
INJ5_CPU: IC1.11(EI) R16.2 U4.112(A:PTC7/CMP0_IN1)
INJ5_TC4: IC1.12(EO) R88.1 U$19.G
INJ6_CPU: IC1.14(FI) R10.2 U4.67(A:PTA15)
INJ6_TC4: IC1.15(FO) R89.1 U$20.G
INJ7_CPU: IC2.3(AI) R1.2 U4.47(A:PTE26)
INJ7_TC4: IC2.2(AO) R90.1 U$21.G
INJ8_CPU: IC2.5(BI) R2.2 U4.55(A:PTA5)
INJ8_TC4: IC2.4(BO) R91.1 U$22.G
INJECTOR1: D22.A J4.11 LED12.C R103.2 U$12.D
INJECTOR2: D23.A J3.31 LED13.C R134.2 U$4.D
INJECTOR3: D24.A J3.23 LED14.C R136.2 U$6.D
INJECTOR4: D25.A J3.27 LED15.C R139.2 U$8.D
INJECTOR5: D4.A J3.29 LED8.C R81.2 U$19.D
INJECTOR6: D14.A J3.19 LED9.C R85.2 U$20.D
INJECTOR7: D20.A J4.25 LED10.C R87.2 U$21.D
INJECTOR8: D21.A J4.26 LED11.C R101.2 U$22.D
LC1: J3.25 J4.1 Q3.3(D)
LC1_CPU: R62.2 U4.132(A:PTD5/ADC0_SE6B)
MAP_CONV: JP20.1 R124.2
MAP_CPU: U2.8(OUT) U2.9(-IN) U4.82(A:PTB1/ADC0_SE9/ADC1_SE9)
MAP_EXT: J4.31 JP22.1
N$1: LED8.A R80.2
N$2: LED5.A R82.2
N$3: R67.1 U$9.5(OUT_B)
N$5: R68.1 U$9.7(OUT_A)
N$6: R35.1 U$11.5(OUT_B)
N$8: R36.1 U$11.7(OUT_A)
N$9: Q2.1(G) R50.1 R61.1
N$11: Q3.1(G) R62.1 R69.1
N$12: R22.1 U1.8(RS)
N$13: R78.1 R79.2 U3.10(+IN)
N$14: J3.7
N$15: R76.1 R77.2 U3.3(+IN)
N$16: LED1.A R30.1
N$17: R116.1 R117.2 U3.5(+IN)
N$18: LED9.A R84.2
N$19: C4.1 C6.+ L2.1 STEPSTICK-X.VMOT
N$20: LED11.A R100.2
N$21: LED15.A R138.2
N$22: LED10.A R86.2
N$25: LED2.A R31.1
N$27: C19.1 R46.1 R47.2 R48.1
N$29: Q4.1(G) R71.1 R74.1
N$31: LED12.A R102.2
N$32: C17.2 PS1.4(VOUT) R45.1
N$34: LED16.A R140.2
N$35: C25.2 R57.1 U$10.9(9_IN2+)
N$36: C26.1 R60.1 U$10.16(16_IN1+)
N$37: C26.2 R59.1 U$10.15(15_IN1-)
N$38: C25.1 R28.1 U$10.10(10_IN2-)
N$39: R106.1 U$25.5(OUT_B)
N$40: R107.1 U$25.7(OUT_A)
N$41: R25.1 R60.2
N$42: R110.1 U$26.5(OUT_B)
N$43: R111.1 U$26.7(OUT_A)
N$44: LED20.A R112.1
N$45: LED21.A R113.1
N$46: LED22.A R114.1
N$47: LED23.A R115.1
N$49: LED7.C R65.2
N$50: LED6.C R64.2
N$51: 12V.A R23.1
N$54: 5V.A R130.1
N$55: R26.1 R59.2
N$56: R27.1 R57.2
N$57: R28.2 R56.1
N$58: R122.1 R123.2 U2.3(+IN)
N$59: R118.1 R119.2 U3.12(+IN)
N$65: R124.1 R125.2 U2.10(+IN)
N$66: R126.1 R127.2 U2.5(+IN)
N$67: R128.1 R129.2 U2.12(+IN)
N$68: JP1.1 R122.2
N$69: JP2.1 U2.1(OUT) U2.2(-IN)
N$70: JP3.1 R126.2
N$71: JP4.1 U2.6(-IN) U2.7(OUT)
N$72: LED3.A R120.1
N$73: LED4.A R121.1
N$74: R131.2 U$18.3
N$75: D16.C L1.2 L3.2
N$76: C45.+ L1.1 U$28.1(IN)
N$77: 5V1.A R132.1
N$78: C28.+ L3.1 U$27.1(IN)
N$79: LED13.A R133.2
N$81: 3V3.A R137.1
N$83: LED14.A R135.2
N$84: LED17.A R142.2
N$87: LED18.A R144.2
N$91: Q1.1(G) R72.1 R73.1
N$326: JP15.1 R107.2
N$327: JP16.1 R111.2
N$328: JP18.2 R106.2
N$329: JP17.2 R110.2
N$338: JP20.3 JP21.1
N$339: C18.2 JP20.2 R45.2
N$340: FL1.1 R17.1
N$341: D31.C D32.C U4.42(C:VBAT)
N$342: C29.2 D29.C D30.C D31.A D32.A U5.1(VIN_2) U5.6(VIN)
N$343: D29.A D30.A FL1.2
N$344: C35.2 U4.37(B:VREF_OUT/CMP1_IN5/CMP0_IN5/ADC1_SE18)
N$345: C38.2 R19.1 U4.32(B:VREFH)
N$346: C39.2 FL2.1
N$347: U6.4(PTA4) U6.13(PTB5/IRQ_12)
N$348: U4.40(B:XTAL32) Y1.1
N$351: U4.41(B:EXTAL32) Y1.2
N$352: U4.125(A:PTC18) Y2.2
N$353: U4.126(A:PTC19) Y2.1
O2: C2.1 D1.A D2.C R21.2 R116.2
O2_2: C37.1 D15.A D17.C R37.2 R128.2
O2_2_CPU: U2.13(-IN) U2.14(OUT) U4.38(B:DAC0_OUT/CMP1_IN3/ADC0_SE23)
O2_2_SENSOR: C36.1 J3.14 R37.1
O2_CPU: U3.6(-IN) U3.7(OUT) U4.39(B:DAC1_OUT/CMP0_IN4/CMP2_IN3/ADC1_SE23)
O2_SENSOR: C1.1 J3.21 R21.1
PROG: TP1.TP U4.51(A:PTA1/JTAG_TDI/EZP_DI)
PTA0: U4.50(A:PTA0/JTAG_TCLK/SWD_CLK/EZP_CLK) U6.8(PTB0/IRQ_5)
PTA2: U4.52(A:PTA2/JTAG_TDO/TRACE_SWO/EZP_DO) U6.9(PTB1/IRQ_6)
PTA3: U4.53(A:PTA3/JTAG_TMS/SWD_DIO) U6.7(PTA7/IRQ_4)
PTE0: J2.8(DAT1) U4.1(A:PTE0/ADC1_SE4A)
PTE1: J2.7(DAT0) U4.2(A:PTE1/LLWU_P0/ADC1_SE5A)
PTE2: J2.5(CLK) U4.3(A:PTE2/LLWU_P1/ADC0_DP2/ADC1_SE6A)
PTE3: J2.3(CMD) U4.4(A:PTE3/ADC0_DM2/ADC1_SE7A)
PTE4: J2.2(CD/DAT3) U4.7(A:PTE4/LLWU_P2)
PTE5: J2.1(DATA2) U4.8(A:PTE5)
RST_CPU: C21.1 D13.A R49.2 U4.74(B:RESET_B)
RX5: J4.5 U4.46(A:PTE25/ADC0_SE18)
RX_CPU: J3.18 U4.95(A:PTB16)
SCL: J3.5 U4.83(A:PTB2/ADC0_SE12)
SDA: J3.2 U4.84(A:PTB3/ADC0_SE13)
STEP_1A: J4.14 STEPSTICK-X.1A
STEP_1B: J4.12 STEPSTICK-X.1B
STEP_2A: J4.10 STEPSTICK-X.2A
STEP_2B: J4.9 STEPSTICK-X.2B
STP: STEPSTICK-X.SPT(STEP) U4.113(A:PTC8/ADC1_SE4B/CMP0_IN2)
TACHO: J4.32 Q4.3(D) R75.1
TACHO_CPU: R71.2 U4.133(A:PTD6/LLWU_P15/ADC0_SE7B)
TPS: C14.1 D9.A D10.C R44.2 R118.2
TPS_CPU: U3.13(-IN) U3.14(OUT) U4.81(A:PTB0/LLWU_P5/ADC0_SE8/ADC1_SE8)
TPS_SIGNAL: C13.1 J4.20 R44.1
TX5: J4.4 U4.45(A:PTE24/ADC0_SE17)
TX_CPU: J3.16 U4.96(A:PTB17)
USBD_N: R58.2 U4.20(B:USB0_DM)
USBD_P: R39.2 U4.19(B:USB0_DP)
VDDA: C39.1 FL3.1 R19.2 U4.31(C:VDDA)
VIN: J4.34 U$18.1 U$18.2 U$18.6 U$18.7
VR1+: J3.8 R25.2 R29.1
VR1-: J3.6 R26.2 R29.2
VR2+: J4.24 R27.2 R32.2
VR2-: J4.6 R32.1 R56.2
VREFL: C35.1 C38.1 U4.33(B:VREFL) U4.34(C:VSSA)
Unconnected: J1.4(ID) J3.10 J3.12 J3.22 J3.24 J3.26 J3.28 J3.30 J3.35 J3.36 J4.2 J4.7 J4.16 J4.18 J4.23 J4.28 J4.30 J4.35 J4.36 PS1.1(NC) PS1.5(NC) PS1.6(NC) STEPSTICK-X.EN STEPSTICK-X.MS1 STEPSTICK-X.MS2 STEPSTICK-X.MS3 U1.5(VREF) U4.9(A:PTE6) U4.10(A:PTE7) U4.11(A:PTE8) U4.12(A:PTE9) U4.13(A:PTE10) U4.14(A:PTE11) U4.15(A:PTE12) U4.23(B:ADC0_DP1) U4.24(B:ADC0_DM1) U4.25(B:ADC1_DP1) U4.26(B:ADC1_DM1) U4.27(B:ADC0_DP0/ADC1_DP3) U4.28(B:ADC0_DM0/ADC1_DM3) U4.35(B:ADC1_SE16/CMP2_IN2/ADC0_SE22) U4.36(B:ADC0_SE16/CMP1_IN2/ADC0_SE21) U4.48(A:PTE27) U4.49(A:PTE28) U4.54(A:PTA4/LLWU_P3/NMI_B/EZP_CS_B) U4.58(A:PTA6) U4.59(A:PTA7/ADC0_SE10) U4.60(A:PTA8/ADC0_SE11) U4.61(A:PTA9) U4.62(A:PTA10) U4.63(A:PTA11) U4.72(A:PTA18/EXTAL0) U4.73(A:PTA19/XTAL0) U4.75(A:PTA24) U4.76(A:PTA25) U4.77(A:PTA26) U4.78(A:PTA27) U4.79(A:PTA28) U4.80(A:PTA29) U4.85(A:PTB4/ADC1_SE10) U4.86(A:PTB5/ADC1_SE11) U4.87(A:PTB6/ADC1_SE12) U4.88(A:PTB7/ADC1_SE13) U4.89(A:PTB8) U4.90(A:PTB9) U4.99(A:PTB20) U4.100(A:PTB21) U4.101(A:PTB22) U4.102(A:PTB23) U4.117(A:PTC12) U4.118(A:PTC13) U4.119(A:PTC14) U4.120(A:PTC15) U4.123(A:PTC16) U4.124(A:PTC17) U4.137(A:PTD8) U4.138(A:PTD9) U4.139(A:PTD10) U4.140(A:PTD11) U4.141(A:PTD12) U4.142(A:PTD13) U4.143(A:PTD14) U4.144(A:PTD15) U5.3(NC) U6.3(PTA3) U6.5(PTA5) U6.6(PTA6) U6.10(PTB2/IRQ_7) U6.11(PTB3/IRQ_10) U6.12(PTB4/IRQ_11) U6.14(PTA0/IRQ_0) U6.15(PTA1/IRQ_1/LPTMR0_ALT1) U6.16(PTA2) U$9.1(NC) U$9.8(NC) U$10.2(2_EXT1) U$10.7(7_EXT2) U$10.12(12_DIRN) U$11.1(NC) U$11.8(NC) U$18.5 U$25.1(NC) U$25.8(NC) U$26.1(NC) U$26.8(NC)

## Buses
B$1

## Notes on the sheet
- POWER SUPPLY 5V 3A MAX. + 3V3 0.8A MAX. | BATTERY REVERSE PROTECTION
- O2_2 SENSOR | SB ECU 1.0
- Designed for Speeduino firmware
- SB Toonz
- www.sbtoonz.com | 08/14/2020
- STEPPER DRIVER
- INJECTOR 5 | GENERIC OUT2 - HIGH CURRENT | INJECTOR 1 | RESET PROTECTION
- INJECTOR 6 | GENERIC OUT1 - HIGH CURRENT | INJECTOR 2 | MAP SENSOR
- BRV / BATTERY REFERENCE VOLTAGE
- IDLE | INJECTOR 3
- INJECTOR 7
- INJECTOR 4
- BOOST
- INJECTOR 8
- LOGIC LEVEL CONVERTER | IAT / INLET AIR TEMPERATURE SENSOR | CLT / COOLANT TEMPERATURE SENSOR
- LOGIC CONVERTERS
- TPS / THROTTLE POSITION SENSOR | O2 SENSOR
- LC1
- FUEL PUMP
- CRANK AND CAM SENSORS
- TACHOMETER
- FAN
- CLUTCH CONTROL
- IGNITION | LOGIC LEVEL CONVERTER
- CAN

## Power pins joined to a net without a drawn wire
EXP: U6.17(EXP)
SHIELD: J1.S1(SHIELD) J1.S2(SHIELD) J1.S3(SHIELD) J1.S4(SHIELD)
VOUT33: U4.21(B:VOUT33)

## Library data of the parts
3V3 5V 5V1 12V LED1-LED18 LED20-LED23 = led:LED: LED OSRAM: - CHIPLED LG R971, LG N971, LY N971, LG Q971, LY Q971, LO R971, LY R971 LH N974, LH R974 LS Q976, LO Q976, LY Q976 LO Q996 - Hyper CHIPLED LW Q18S LB Q993, LB Q99A, LB R99A - SideLED LS A670, LO A670, LY A670, LG A670, LP A670 LB A673, LV A673, LT A673, LW A673 LH A674 LY A675 LS A676, LA A676, LO A676, LY A676, LW A676 LS A679, LY A679, LG A679 - Hyper Micro SIDELED® LS Y876, LA Y876, LO Y876, LY Y876 LT Y87S - SmartLED LW L88C, LW L88S LB L89C, LB L89S, LG L890 LS L89K, LO L89K, LY L89K LS L896, LA L896, LO L896, LY L896 - TOPLED LS T670, LO T670, LY T670, LG T670, LP T670 LSG T670, LSP T670, LSY T670, LOP T670, LYG T670 LG T671, LOG T671, LSG T671 LB T673, LV T673, LT T673, LW T673 LH T674 LS T676, LA T676, LO T676, LY T676, LB T676, LH T676, LSB T676, LW T676 LB T67C, LV T67C, LT T67C, LS T67K, LO T67K, LY T67K, LW E67C LS E67B, LA E67B, LO E67B, LY E67B, LB E67C, LV E67C, LT E67C LW T67C LS T679, LY T679, LG T679 LS T770, LO T770, LY T770, LG T770, LP T770 LB T773, LV T773, LT T773, LW T773 LH T774 LS E675, LA E675, LY E675, LS T675 LS T776, LA T776, LO T776, LY T776, LB T776 LHGB T686 LT T68C, LB T68C - Hyper Mini TOPLED® LB M676 - Mini TOPLED Santana® LG M470 LS M47K, LO M47K, LY M47K Source: http://www.osram.convergy.de LUXEON: - LUMILED® LXK2-PW12-R00, LXK2-PW12-S00, LXK2-PW14-U00, LXK2-PW14-V00 LXK2-PM12-R00, LXK2-PM12-S00, LXK2-PM14-U00 LXK2-PE12-Q00, LXK2-PE12-R00, LXK2-PE12-S00, LXK2-PE14-T00, LXK2-PE14-U00 LXK2-PB12-K00, LXK2-PB12-L00, LXK2-PB12-M00, LXK2-PB14-N00, LXK2-PB14-P00, LXK2-PB14-Q00 LXK2-PR12-L00, LXK2-PR12-M00, LXK2-PR14-Q00, LXK2-PR14-R00 LXK2-PD12-Q00, LXK2-PD12-R00, LXK2-PD12-S00 LXK2-PH12-R00, LXK2-PH12-S00 LXK2-PL12-P00, LXK2-PL12-Q00, LXK2-PL12-R00 Source: www.luxeon.com KINGBRIGHT: KA-3528ASYC Source: www.kingbright.com
C1-C5 C9-C27 C30 C33 C36 C37 C40-C44 C46-C49 = resistor:C-EU: CAPACITOR, European symbol
C6-C8 C28 C31 C45 = resistor:CPOL-EU: POLARIZED CAPACITOR, European symbol
C29 C35 C38 C50 = C0805X104K1REC:C0805X104K1REC: Buy Part <https://snapeda.com/parts/C0805X104K1REC/KEMET/view-part/?ref=eda>; AVAILABILITY: Bad; DESCRIPTION: CAP CER 0805 0.1UF 100V X7R; MF: KEMET; MP: C0805X104K1REC; PACKAGE: 2012 KEMET; PRICE: None
C32 C34 C39 C53 = C0805X225J4REC:C0805X225J4REC; AVAILABILITY: Unavailable; DESCRIPTION: CAP CER 0805 2.2UF 16V X7R 5%; MF: KEMET; MP: C0805X225J4REC; PACKAGE: 2012 KEMET; PRICE: None
C51 C52 = C0805X103MMGEC:C0805X103MMGEC: Buy Part <https://snapeda.com/parts/C0805X103MMGEC/KEMET/view-part/?ref=eda>; AVAILABILITY: Bad; DESCRIPTION: CAP CER 0805 10NF 63V C0G 20%; MF: KEMET; MP: C0805X103MMGEC; PACKAGE: 2012 KEMET; PRICE: None
D1-D15 D17 D20-D28 = diode:DIODE-: DIODE
D16 D18 D19 = DO-214AC:S1*: S1A - S1M General Purpose Rectifiers Source: http://www.fairchildsemi.com/datasheets/S1/S1A.pdf; MF: Fairchild; MPN: S1A; OC_FARNELL: 9843868; OC_NEWARK: 58K9551
D29-D32 = BAT20JFILM:BAT20JFILM: 23V, 1A Schottky diode, SOD-323 package Buy Part <https://snapeda.com/parts/BAT20JFILM/STMicroelectronics/view-part/?ref=eda>; ARROW_ELECTRONICS-PURCHASE-URL: https://snapeda.com/shop?store=Arrow+Electronics&id=110314; AVAILABILITY: Good; DESCRIPTION: Diode Schottky 23V 1A Surface Mount SOD-323; DIGIKEY-PURCHASE-URL: https://snapeda.com/shop?store=DigiKey&id=110314; MF: STMicroelectronics; MOUSER-PURCHASE-URL: https://snapeda.com/shop?store=Mouser&id=110314; MP: BAT20JFILM; PACKAGE: SOD-323 STMicroelectronics; PRICE: None
FL1 = BLM03AX121SN1D:BLM03AX121SN1D: Ferrite, Bead, 0201, 0.23Ohm, 0.45A; AVAILABILITY: Unavailable; DESCRIPTION: 120 Ohms @ 100MHz 1 Ferrite Bead 0201 (0603 Metric) 450mA 230mOhm; MF: Murata; MP: BLM03AX121SN1D; PACKAGE: 0603 Murata; PRICE: None
FL2 FL3 = BLM18DN601SH1D:BLM18DN601SH1D: Buy Part <https://snapeda.com/parts/BLM18DN601SH1D/Murata/view-part/?ref=eda>; ARROW_ELECTRONICS-PURCHASE-URL: https://snapeda.com/shop?store=Arrow+Electronics&id=4302287; AVAILABILITY: Good; DESCRIPTION: 600 Ohms @ 100MHz 1 Ferrite Bead 0603 (1608 Metric) 700mA; DIGIKEY-PURCHASE-URL: https://snapeda.com/shop?store=DigiKey&id=4302287; MF: Murata; MOUSER-PURCHASE-URL: https://snapeda.com/shop?store=Mouser&id=4302287; MP: BLM18DN601SH1D; PACKAGE: 1608 Murata; PRICE: None
IC1 IC2 = 45xx:4504: TTL or CMOS to CMOS hex LEVEL SHIFTER
IC3 = lm1117:LM1117IMPX-*
J1 = 2134441-2:2134441-2: Conn Micro USB RCP 5 POS 0.65mm Solder RA SMD 5 Terminal 1 Port T/R Buy Part <https://snapeda.com/parts/2134441-2/TE%20Connectivity/view-part/?ref=eda>; AVAILABILITY: Warning; COMMENT: 2134441-2; DESCRIPTION: Conn Micro USB RCP 5 POS 0.65mm Solder RA SMD 5 Terminal 1 Port T/R; DIGIKEY-PURCHASE-URL: https://snapeda.com/shop?store=DigiKey&id=515262; MF: TE Connectivity; MP: 2134441-2; PACKAGE: None; PRICE: None
J2 = 503182-1852:503182-1852: Micro SD Normal UltraLowPro8CktEmbsTpPkg Source: Datasheet <https://www.molex.com/pdm_docs/sd/5031821852_sd.pdf>; ARROW_PART_NUMBER: 503182-1852; DESCRIPTION: Micro SD Normal UltraLowPro8CktEmbsTpPkg; HEIGHT: mm; MANUFACTURER_NAME: Molex; MANUFACTURER_PART_NUMBER: 503182-1852; MOUSER_PART_NUMBER: 538-503182-1852; MOUSER_PRICE-STOCK: https://www.mouser.co.uk/ProductDetail/Molex/503182-1852?qs=s7UCm7gO1bZmpyAhCKZ26g%3D%3D
J3 J4 = MX23A34NF1:MX23A34NF1: Automotive Connectors 34P Std Pin Header Source: Datasheet <https://www.jae.com/z-en/pdf_download_exec.cfm?param=SJ037391.pdf>; ARROW_PART_NUMBER: MX23A34NF1; DESCRIPTION: Automotive Connectors 34P Std Pin Header; HEIGHT: 19mm; MANUFACTURER_NAME: JAE Electronics; MANUFACTURER_PART_NUMBER: MX23A34NF1; MOUSER_PART_NUMBER: 656-MX23A34NF1; MOUSER_PRICE-STOCK: https://www.mouser.co.uk/ProductDetail/JAE-Electronics/MX23A34NF1?qs=6xtm2vwqiW%252BG%252B9dcYpsrBg%3D%3D
JP1-JP4 JP12-JP14 JP19 JP21 JP22 = pinhead:PINHD-1X1: PIN HEADER
JP15-JP18 = pinhead:PINHD-1X2: PIN HEADER
JP20 = jump-0r-smd:0R-JUMP: SMD 0R 0805 Jumper
L1 L3 = rc-master-smd:FB_: FERRITE BEAD
L2 = Wurth Passive:WE-PD: SMD Shielded Power Inductor Characteristics Magnetically shielded version which results in a low leakage field High Saturation currents up to 25 A Very low self-losses at high switching frequency‘s Wide inductances spectrum available at all sizes Operating temperature: –40 °C to +125 °C Applications Perfectly suitable for switching regulators with extremely high efficiency Integrated DC/DC- converter Switching regulators with low operating voltages (Graphic cards, embedded PC-Cards, Mainboards) Plastic base: Because of the one piece construction these are more suitable for high vibration or shock applications <http://katalog.we-online.de/media/images/eisos/FePBF_pf2.jpg> Details see: http://katalog.we-online.de/en/pbs/WE-PD? Updated by Dan Xu 2014-07-08 2014 (C) Wurth Elektronik
PS1 = mpx-freescale:MPXH6400A: High Temperature Accuracy Integrated Silicon Pressure Sensor for Measuring Absolute Pressure, On-Chip Signal Conditioned, Temperature Compensated and Calibrated INTEGRATED PRESSURE SENSOR 20 TO 400 kPA (3.0 TO 58 psi) 0.2 TO 4.8 V OUTPUT (3.0 TO 58 psi)
Q1-Q4 = ipc-7351-transistor:MOSFET-NCH_
R1-R16 R18 R20-R38 R40-R57 R59-R91 R100-R145 = resistor:R-EU_: RESISTOR, European symbol
R17 = PICOSMDC050S-2:PICOSMDC050S-2: FUSE, RESETTABLE PTC, 6VDC, 0.5A, SMD Buy Part <https://snapeda.com/parts/PICOSMDC050S-2/Littelfuse%20Inc./view-part/?ref=eda>; AVAILABILITY: Good; DESCRIPTION: Polymeric PTC Resettable Fuse 6V 500mA Ih Surface Mount 0805 (2012 Metric), Concave; DIGIKEY-PURCHASE-URL: https://snapeda.com/shop?store=DigiKey&id=1315044; MF: Littelfuse Inc.; MOUSER-PURCHASE-URL: https://snapeda.com/shop?store=Mouser&id=1315044; MP: PICOSMDC050S-2; PACKAGE: 0805 TE Connectivity; PRICE: None
R19 = SR0805MR-7W470RL:SR0805MR-7W470RL: Buy Part <https://snapeda.com/parts/SR0805MR-7W470RL/Yageo/view-part/?ref=eda>; AVAILABILITY: Bad; DESCRIPTION: RES 470 OHM 20% 1/4W 0805; MF: Yageo; MP: SR0805MR-7W470RL; PACKAGE: 2012 Rohm Semiconductor; PRICE: None
R39 R58 = SR0805MR-0733RL:SR0805MR-0733RL: Buy Part <https://snapeda.com/parts/SR0805MR-0733RL/Yageo/view-part/?ref=eda>; AVAILABILITY: Bad; DESCRIPTION: RES 33 OHM 20% 1/8W 0805; MF: Yageo; MP: SR0805MR-0733RL; PACKAGE: 2012 Rohm Semiconductor; PRICE: None
STEPSTICK-X = Arduino library Stepstick:STEP-STICK
TP1 = testpad:PTR1: TEST PIN
U1 = SN65HVD230QDR:SN65HVD230QDR: Automotive Catalog 3.3-V CAN Transceivers 8-SOIC -40 to 125; AVAILABILITY: Good; DESCRIPTION: Automotive Catalog 3.3-V CAN Transceivers 8-SOIC -40 to 125; MF: Texas Instruments; MP: SN65HVD230QDR; PACKAGE: SOIC-8 Texas Instruments; PRICE: 1.62 USD
U2 U3 = SparkFun-IC-Amplifiers:LMV324: IC LMV324 Quad Op Amp Jellybean quad op-amp Datasheet <http://cdn.sparkfun.com/datasheets/Sensors/Sound/LMV324.pdf> SparkFun Products SparkFun Sensor Kit <https://www.sparkfun.com/products/13754> (DEV-13754) SparkFun Inventor's Kit for Arduino 101 <https://www.sparkfun.com/products/13844> (KIT-13844) SparkFun Sound Detector <https://www.sparkfun.com/products/12642> (SEN-12642); PROD_ID: IC-08227
U4 = Freescale Semiconductor - MK64FX512VLQ12:FREESCALE_SEMICONDUCTOR_MK64FX512VLQ12: FRES-MK64FX512VLQ12-144; CIIVA_IDS: 12547107; COMPONENT_LINK_1_DESCRIPTION: Manufacturer URL; COMPONENT_LINK_1_URL: http://www.freescale.com/; COMPONENT_LINK_3_DESCRIPTION: Package Specification; COMPONENT_LINK_3_URL: http://cache.freescale.com/files/shared/doc/package_info/98ASS23177W.pdf; DATASHEET: http://cache.freescale.com/files/microcontrollers/doc/data_sheet/K64P144M120SF5.pdf?pspll=1; DATASHEET_VERSION: Rev. 3; FLASH: 512 kB; FOOTPRINT_VARIANT_NAME_0: Level C; FOOTPRINT_VARIANT_NAME_1: Level B; FOOTPRINT_VARIANT_NAME_2: Level A; IMPORTED: yes; IMPORTED_FROM: vault; IMPORT_TS: 1521854295; MF: Freescale Semiconductor; MOUNTING_TECHNOLOGY: Surface Mount; MPN: MK64FX512VLQ12; PACKAGE_DESCRIPTION: 144-Pin Plastic Quad Flat Package, Body 20 x 20 mm, Pitch 0.5 mm; PACKAGE_VERSION: Rev. G; PACKING: Tray; PIN_0_0_18_INSIDE_EDGE: clock; PREFIX: U; RELEASE_DATE: 1415010203; ROHS: Yes; SRAM: 256 KB; TEMPERATURE_RANGE: -40 to 105 degC; VAULT_GUID: 0ACE9ED0-D68F-4FA9-92E6-4F5100C95D2D; VAULT_REVISION: C4BE7AC3-66E9-4DA0-A1D0-22F5657AADA0; VBAT: 1.71 to 3.6 V; VDD: 1.71 to 3.6 V; VDDA: 1.71 to 3.6 V
U5 = LP38691SD-ADJ:LP38691SD-ADJ: Linear Regulator; AVAILABILITY: Unavailable; DESCRIPTION: 500-mA, 10-V, adjustable low-dropout voltage regulator 6-WSON -40 to 125; MF: Texas Instruments; MP: LP38691SD-ADJ; PACKAGE: WSON-6 Texas Instruments; PRICE: None
U6 = MKL02Z32VFG4:MKL02Z32VFG4: MCU 32-Bit KL02 ARM Cortex M0+ RISC 32KB Flash 1.8V/2.5V/3.3V 16-Pin QFN EP Tray Buy Part <https://snapeda.com/parts/MKL02Z32VFG4/NXP%20USA/view-part/?ref=eda>; AVAILABILITY: Good; DESCRIPTION: ARM® Cortex®-M0+ Kinetis KL02 Microcontroller IC 32-Bit 48MHz 32KB (32K x 8) FLASH 16-QFN (3x3); DIGIKEY-PURCHASE-URL: https://snapeda.com/shop?store=DigiKey&id=492537; MF: NXP USA; MOUSER-PURCHASE-URL: https://snapeda.com/shop?store=Mouser&id=492537; MP: MKL02Z32VFG4; PACKAGE: QFN-16 NXP Semiconductors; PRICE: None
U$2-U$6 U$8 U$12 U$13 U$19-U$22 = VND14NV04:DPAK_N-CHANNEL_MOSFET: VND14NV04
U$9 U$11 U$25 U$26 = TC426,427,428:TC427
U$10 = max9926:MAX9926
U$18 = VN5R003H-E - HPAK:VN5R003H-E
U$27 U$28 = MIC29301-5.0WU-TR - regulator 5V liniowy 3A:MIC29301-5.0WU-TR
Y1 = ABS07-32.768KHZ-T:ABS07-32.768KHZ-T: ABS07 Series 32.768 kHz ±20 ppm 12.5 pF -40 to +85 °C SMT Low Profile Crystal Buy Part <https://snapeda.com/parts/ABS07-32.768KHZ-T/Abracon/view-part/?ref=eda>; AVAILABILITY: Good; DESCRIPTION: 32.768kHz ±20ppm Crystal 12.5pF 70 kOhms 2-SMD, No Lead; DIGIKEY-PURCHASE-URL: https://snapeda.com/shop?store=DigiKey&id=51000; MF: Abracon; MOUSER-PURCHASE-URL: https://snapeda.com/shop?store=Mouser&id=51000; MP: ABS07-32.768KHZ-T; PACKAGE: SMD-2 Abracon LLC; PRICE: None
Y2 = ECS-160-20-5P-DN-TR:ECS-160-20-5P-DN-TR: CRYSTAL SMD Buy Part <https://snapeda.com/parts/ECS-160-20-5P-DN-TR/ECS%20International/view-part/?ref=eda>; AVAILABILITY: Warning; DESCRIPTION: Crystals 16MHz 20pF EX/TEMP CSM-7; MF: ECS International; MOUSER-PURCHASE-URL: https://snapeda.com/shop?store=Mouser&id=554226; MP: ECS-160-20-5P-DN-TR; PACKAGE: HC49/US ECS International; PRICE: None